# EAGLE design big_seven_v0.1 (EAGLE 6.5.0)
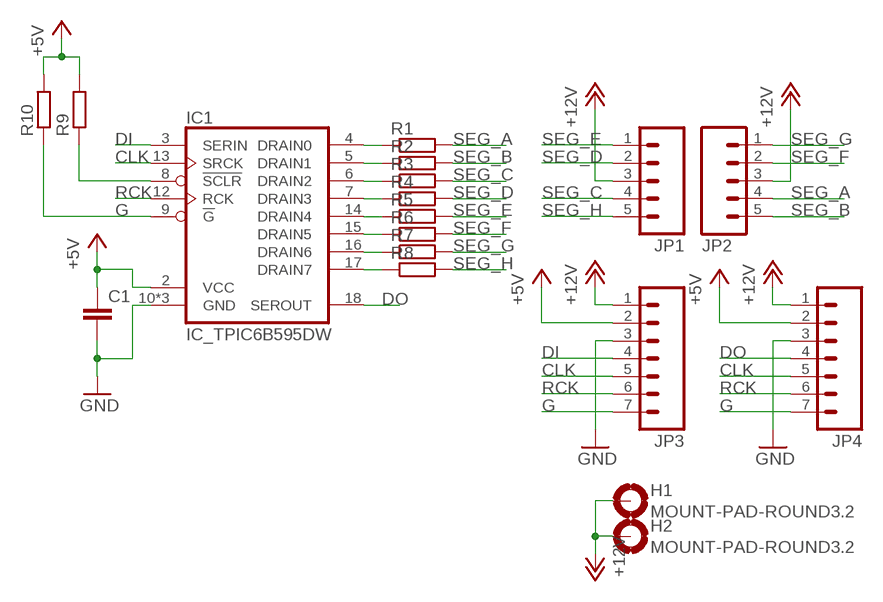
[diagram p0: schematic, sheet 1]

## Parts
C1  C-EUC0805  [C0805]
H1  MOUNT-PAD-ROUND3.2  [3,2-PAD]
H2  MOUNT-PAD-ROUND3.2  [3,2-PAD]
IC1  IC_TPIC6B595DW  [SOIC-20]
JP1  M05PTH  [1X05]
JP2  M05PTH  [1X05]
JP3  M07LONGPADS  [1X07_LONGPADS]
JP4  M07LONGPADS  [1X07_LONGPADS]
R1  R-EU_M0805  [M0805]
R2  R-EU_M0805  [M0805]
R3  R-EU_M0805  [M0805]
R4  R-EU_M0805  [M0805]
R5  R-EU_M0805  [M0805]
R6  R-EU_M0805  [M0805]
R7  R-EU_M0805  [M0805]
R8  R-EU_M0805  [M0805]
R9  R-EU_M0805  [M0805]
R10  R-EU_M0805  [M0805]

## Nets
+5V: C1.1 IC1.2(VCC) JP3.2 JP4.2 R9.2 R10.2
+12V: H1.B3,2(MOUNT) H2.B3,2(MOUNT) JP1.3 JP2.3 JP3.1 JP4.1
CLK: IC1.13(SRCK) JP3.5 JP4.5
DI: IC1.3(SERIN) JP3.4
DO: IC1.18(SEROUT) JP4.4
G: IC1.9(!G) JP3.7 JP4.7 R10.1
GND: C1.2 IC1.10(GND) IC1.11(GND) IC1.19(GND) JP3.3 JP4.3
N$1: IC1.4(DRAIN0) R1.1
N$2: IC1.5(DRAIN1) R2.1
N$4: IC1.6(DRAIN2) R3.1
N$5: IC1.7(DRAIN3) R4.1
N$6: IC1.14(DRAIN4) R5.1
N$8: IC1.15(DRAIN5) R6.1
N$9: IC1.16(DRAIN6) R7.1
N$11: IC1.17(DRAIN7) R8.1
N$13: IC1.8(!SCLR) R9.1
RCK: IC1.12(RCK) JP3.6 JP4.6
SEG_A: JP2.4 R1.2
SEG_B: JP2.5 R2.2
SEG_C: JP1.4 R3.2
SEG_D: JP1.2 R4.2
SEG_E: JP1.1 R5.2
SEG_F: JP2.2 R6.2
SEG_G: JP2.1 R7.2
SEG_H: JP1.5 R8.2

## Library data of the parts
C1 = rcl:C-EU: CAPACITOR, European symbol
H1 H2 = holes:MOUNT-PAD-ROUND: MOUNTING PAD, round
IC1 = dp_devices:IC_TPIC6B595
JP1 JP2 = SparkFun-Connectors:M05: Header 5 Standard 5-pin 0.1" header. Use with straight break away headers (SKU : PRT-00116), right angle break away headers (PRT-00553), swiss pins (PRT-00743), machine pins (PRT-00117), and female headers (PRT-00115). Molex polarized connector foot print use with SKU : PRT-08230 with associated crimp pins and housings.
JP3 JP4 = SparkFun-Connectors:M07: Header 7 Standard 7-pin 0.1" header. Use with straight break away headers (SKU : PRT-00116), right angle break away headers (PRT-00553), swiss pins (PRT-00743), machine pins (PRT-00117), and female headers (PRT-00115). NOTES ON THE VARIANTS LOCK and LOCK_LONGPADS... This footprint was designed to help hold the alignment of a through-hole component (i.e. 7-pin header) while soldering it into place. You may notice that each hole has been shifted either up or down by 0.005 of an inch from it's more standard position (which is usually a perfectly straight line). This slight alteration caused the pins (the squares in the middle) to touch the edges of the holes. Because they are alternating, it causes a "brace" to hold the header in place. 0.005 has proven to be the perfect amount of "off-center" position when using our standard breakaway headers. Although looks a little odd when you look at the bare footprint, once you have a header in there, the alteration is very hard to notice. Also, if you push a header all the way into place, it is covered up entirely on the bottom side. This idea of altering the position of holes to aid alignment will be further integrated into the Sparkfun Library for other footprints. It can help hold any component with 3 or more connection pins.
R1-R10 = rcl:R-EU_: RESISTOR, European symbol

## Board
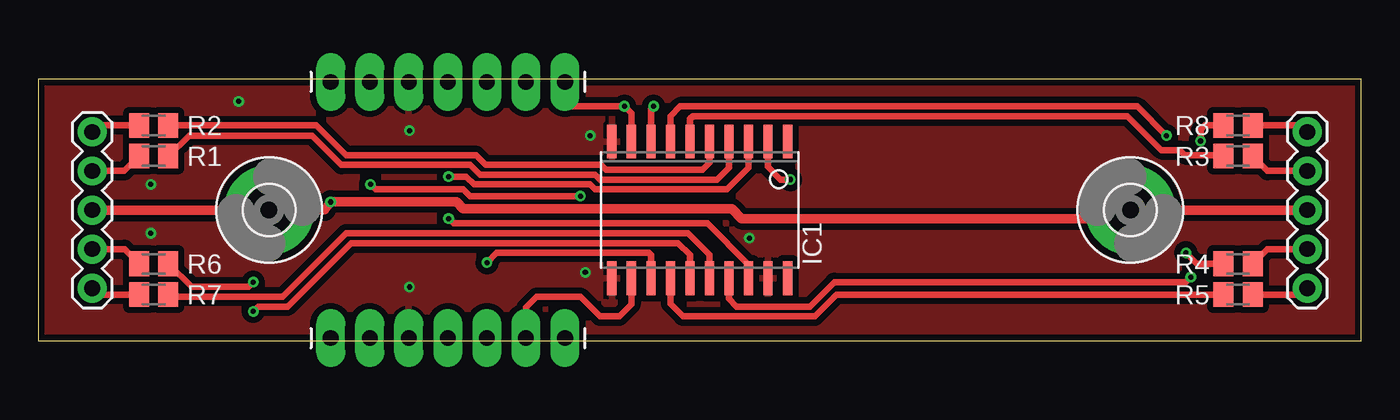
[diagram p1: board, top side]
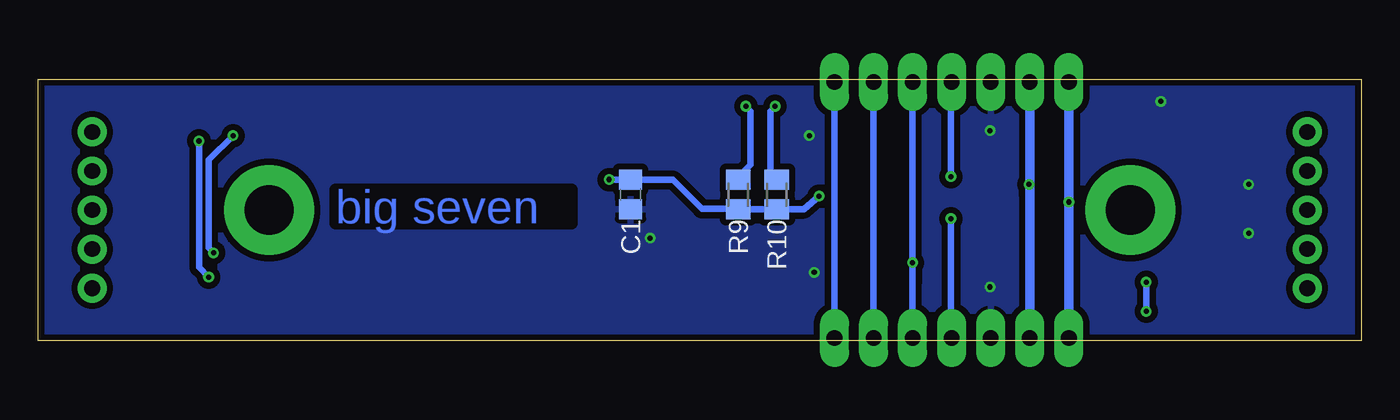
[diagram p2: board, bottom side, seen from below]

Size 86 x 17 mm. Coordinates in mm from the lower left corner, seen from the top.
Outline: 86,0 86,17 0,17 0,0 86,0
Copper layers (1*16): Top 0.0356mm / dielectric 1.5011mm / Bottom 0.0356mm
Design rules "default": minimum track width 6mil, minimum drill 13mil, track to track 6mil, track to pad 6mil, pad to pad 6mil, via to via 6mil, smd to smd 6mil, copper to edge 15mil, drill to drill 6mil, minimum pad ring 7mil, minimum via ring 7mil, stop-mask expansion 3mil, vias tented up to drill 25mil, thermal gap 10mil

### Footprints (pad centres in the part's own frame; a part is rotated, then mirrored left to right if it is on the bottom)
C0805 = smd 1.3 x 1.5: 1 -0.95,0; 2 0.95,0
3,2-PAD = drill 3.2 pad 5.842: B3,2 0,0
SOIC-20 = smd 0.6 x 2.2: 1 -5.715,-4.445; 2 -4.445,-4.445; 3 -3.175,-4.445; 4 -1.905,-4.445; 5 -0.635,-4.445; 6 0.635,-4.445; 7 1.905,-4.445; 8 3.175,-4.445; 9 4.445,-4.445; 10 5.715,-4.445; 11 5.715,4.445; 12 4.445,4.445; 13 3.175,4.445; 14 1.905,4.445; 15 0.635,4.445; 16 -0.635,4.445; 17 -1.905,4.445; 18 -3.175,4.445; 19 -4.445,4.445; 20 -5.715,4.445
1X05 = drill 1.016 pad 1.88: 1 0,0; 2 2.54,0; 3 5.08,0; 4 7.62,0; 5 10.16,0
1X07_LONGPADS = drill 1.016 pad 1.88 long: 1 0,0; 2 2.54,0; 3 5.08,0; 4 7.62,0; 5 10.16,0; 6 12.7,0; 7 15.24,0
M0805 = smd 1.3 x 1.6: 1 -0.95,0; 2 0.95,0

### Placement (x,y rotation side)
C1  47.5,9.5 270 bottom
H1  15,8.5 0 top
H2  71,8.5 90 top
IC1  43,8.5 180 top
JP1  82.5,3.41 90 top
JP2  3.5,3.41 90 top
JP3  19,16.83 0 top
JP4  19,0.17 0 top
R1  7.5,12 180 top
R2  7.5,14 180 top
R3  78,12 0 top
R4  78,5 0 top
R5  78,3 0 top
R6  7.5,5 180 top
R7  7.5,3 180 top
R8  78,14 0 top
R9  40.5,9.5 270 bottom
R10  38,9.5 270 bottom

### Tracks (layer width: path | path; a pad name or v marks a point on that pad's centre or on a via)
+5V  (via drill 0.33)
  Top 0.406: v48.9,10.48 48.26,10.48 47.44,11.29 IC1.2 | v21.59,10.16 21.91,9.84 27.62,9.84 28.07,9.4 v35.24,9.4
  Bottom 0.406: v48.9,10.48 47.53,10.48 C1.1 44.74,10.45 42.86,8.57 40.52,8.57 R9.2 R10.2 36.22,8.55 v35.24,9.4 | v21.59,10.16 21.54,9.53
  Bottom 0.61: 21.54,9.53 JP3.2 JP4.2
+12V  (via drill 0.33)
  Top 0.61: JP1.3 H2.B3,2 70.44,7.94 45.72,7.94 45.09,8.57 27.62,8.57 27.18,9.02 v19,9.02 18.61,8.5 H1.B3,2 JP2.3
  Bottom 0.61: JP3.1 v19,9.02 JP4.1
CLK  (via drill 0.33)
  Top 0.406: IC1.13 39.82,5.58 39.69,5.71 29.8,5.71 v29.16,5.08
  Bottom 0.406: JP4.5 29.16,3.81 v29.16,5.08 JP3.5
DI  (via drill 0.33)
  Top 0.406: IC1.3 46.17,11.25 44.77,9.84 36.2,9.84 35.88,10.16 28.32,10.16 27.81,10.67 v26.67,10.67
  Bottom 0.406: v26.67,10.67 26.67,16.78 JP3.4
DO  (via drill 0.33)
  Top 0.406: IC1.18 46.17,4.94 43.5,7.62 26.99,7.62 v26.67,7.94
  Bottom 0.406: v26.67,7.94 26.67,0.22 JP4.4
G  (via drill 0.33)
  Top 0.406: IC1.9 38.55,14.79 v38.1,15.24 34.61,15.24 34.24,15.61 JP3.7
  Bottom 0.406: 37.71,10.16 R10.1 38.42,10.87 38.42,14.92 v38.1,15.24 | JP4.7 JP3.7
GND  (via drill 0.33)
  other vias: 35.56,4.45 24.13,3.49 24.13,13.65 35.88,13.34 46.23,6.67 7.3,10.16 7.3,6.99 13.02,15.56
  pour Top (isolate 0.406): 0,17 86,17 86,0 0,0
  pour Bottom (isolate 0.406): 86.04,17.14 0,17.14 0,-0.32 86.04,-0.32
N$1
  Top 0.406: R1.1 9.79,13.34 17.78,13.34 19.68,11.43 28.07,11.43 28.7,10.79 36.2,10.79 36.51,10.48 44.13,10.48 44.9,11.25 IC1.4
N$2
  Top 0.406: R2.1 18.07,14 20,12.06 28.45,12.06 29.08,11.43 36.58,11.43 36.89,11.11 43.18,11.11 43.63,11.57 IC1.5
N$4
  Top 0.406: IC1.6 42.36,14.42 42.55,14.61 70.8,14.61 73.03,12.38 74.23,12.38 74.55,12.06 76.98,12.06 R3.1
N$5  (via drill 0.33)
  Top 0.406: IC1.7 41.09,14.61 41.73,15.24 71.44,15.24 v73.34,13.34 | R4.1 75.33,5 v74.61,5.71
  Bottom 0.406: v74.61,5.71 74.93,6.03 74.93,11.75 v73.34,13.34
N$6
  Top 0.406: R5.1 51.9,3 50.48,1.59 41.91,1.59 41.09,2.4 IC1.14
N$8  (via drill 0.33)
  Top 0.406: IC1.15 42.36,5.58 41.59,6.35 26.35,6.35 25.72,6.35 20.32,6.35 16.19,2.22 14.29,2.22 v13.97,1.91 | v13.97,3.81 13.65,3.49 9.96,3.49 R6.1
  Bottom 0.406: v13.97,3.81 v13.97,1.91
N$9
  Top 0.406: R7.1 8.59,2.86 15.88,2.86 20,6.99 42.23,6.99 43.63,5.58 IC1.16
N$11  (via drill 0.33)
  Top 0.406: IC1.17 44.9,2.72 45.4,2.22 50.16,2.22 51.75,3.81 74.61,3.81 v74.93,4.13 | R8.1 75.85,14 75.56,13.72 v75.56,12.98
  Bottom 0.406: v74.93,4.13 75.56,4.76 v75.56,12.98
N$13  (via drill 0.33)
  Top 0.406: IC1.8 39.82,15.06 v40.01,15.24
  Bottom 0.406: R9.1 40.5,10.62 39.69,11.43 39.69,14.92 v40.01,15.24
RCK
  Top 0.406: IC1.12 38.55,2.36 37.78,1.59 36.51,1.59 35.24,2.86 32.38,2.86 31.7,2.17 JP4.6
  Bottom 0.406: JP4.6 JP3.6
SEG_A
  Top 0.406: JP2.4 5.58,11.03 R1.2
SEG_B
  Top 0.406: R2.2 3.93,14 JP2.5
SEG_C
  Top 0.406: JP1.4 79.92,11.03 R3.2
SEG_D
  Top 0.406: JP1.2 79.9,5.95 R4.2
SEG_E
  Top 0.406: R5.2 82.09,3 JP1.1
SEG_F
  Top 0.406: JP2.2 5.6,5.95 R6.2
SEG_G
  Top 0.406: R7.2 3.91,3 JP2.1
SEG_H
  Top 0.406: R8.2 82.08,14 JP1.5

### Text on the board
Bottom: big seven
bStop: big seven